# EAGLE design Logic SchematicV4-NEW (EAGLE 6.4)
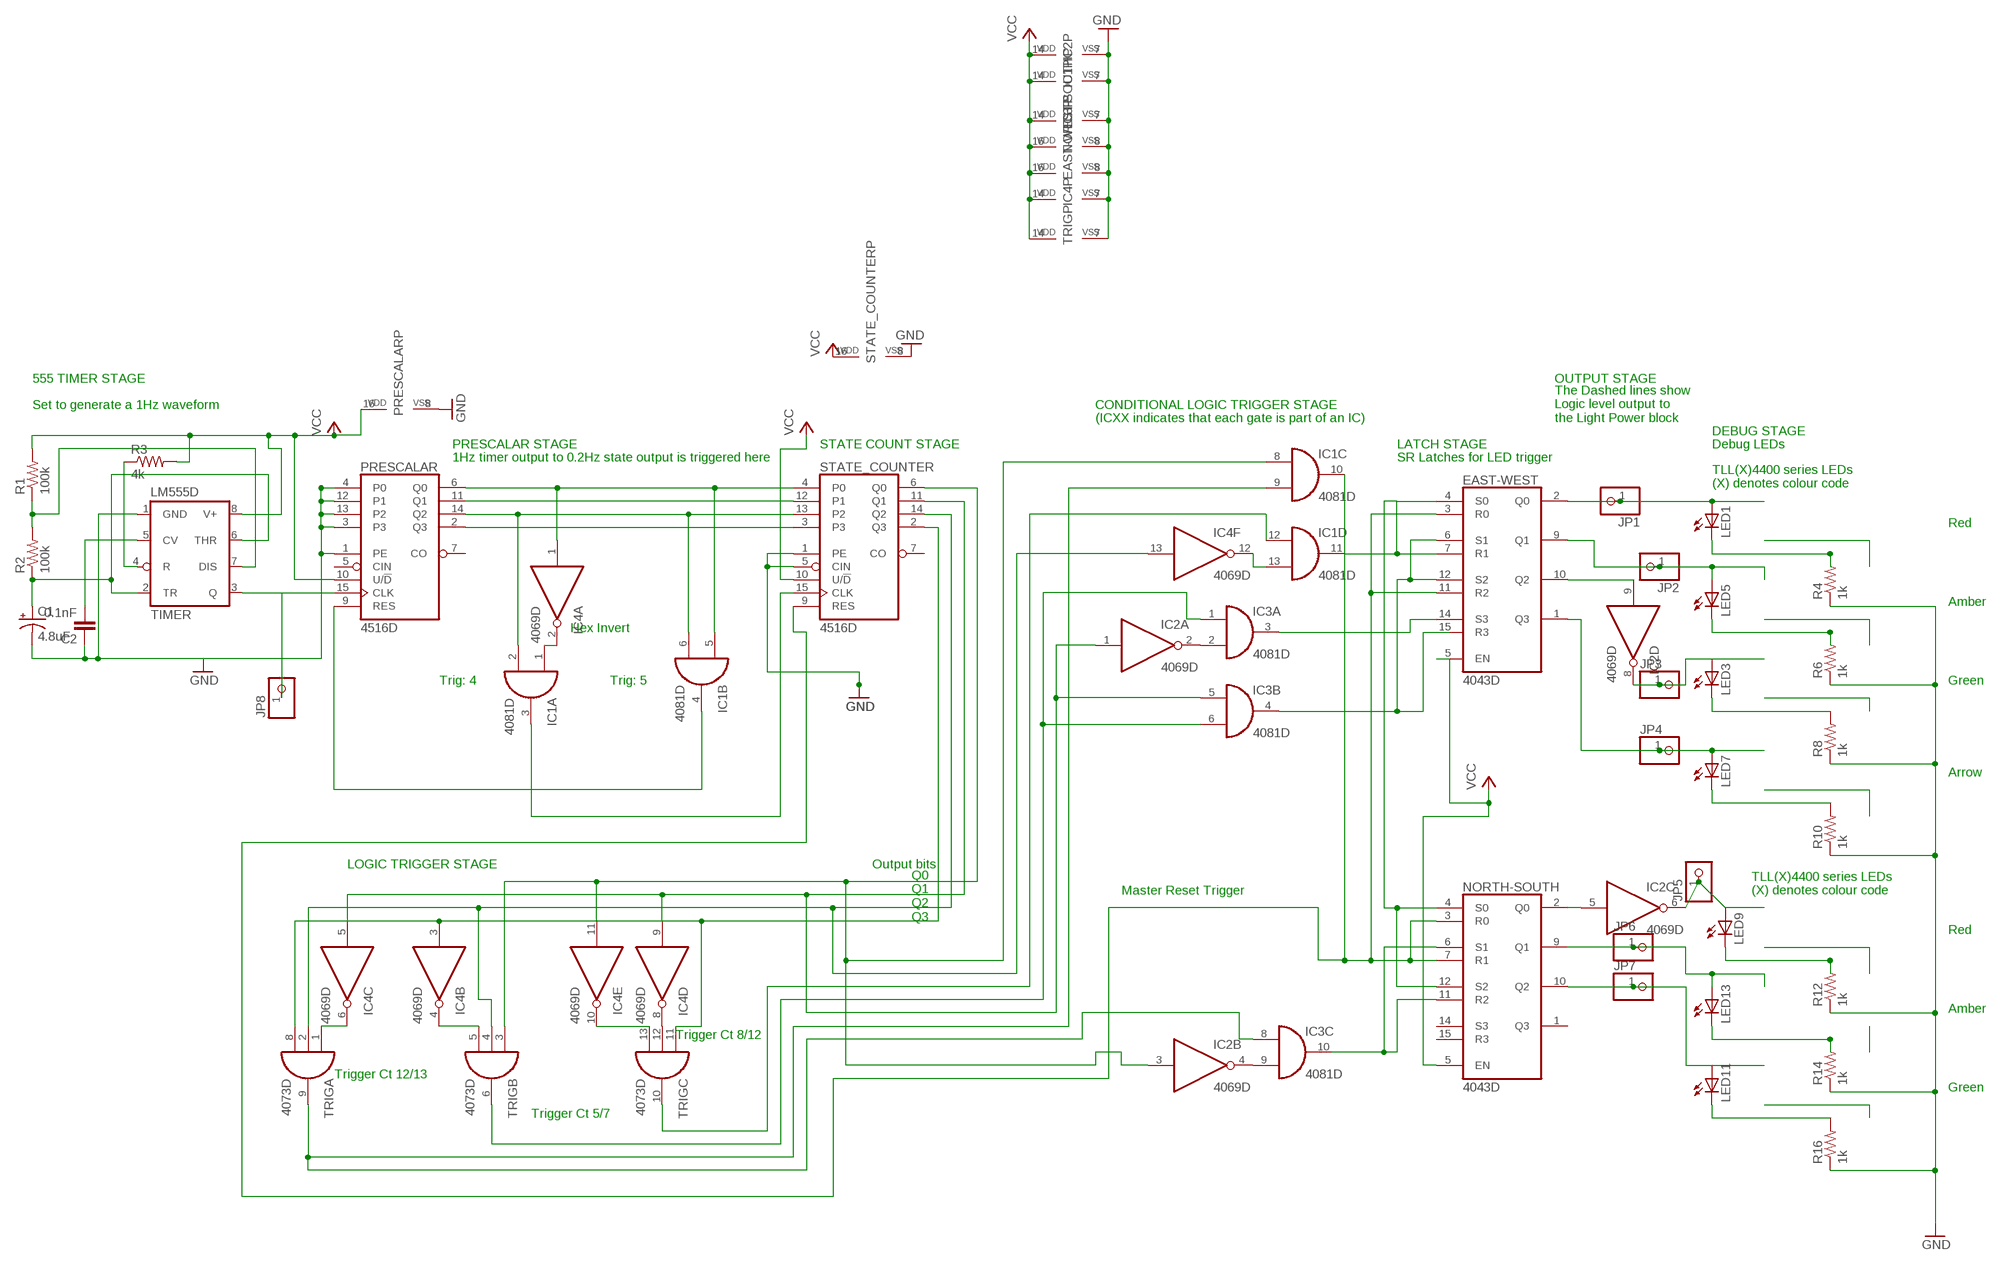
[diagram p0: schematic, sheet 1]

## Parts
C1  4.8uF  CPOL-USE5-8.5  [E5-8,5]
C2  0.1nF  C-EUC0805  [C0805]
EAST-WEST  4043D  [SO16]
IC1  4081D  [SO14]
IC2  4069D  [SO14]
IC3  4081D  [SO14]
IC4  4069D  [SO14]
JP1  PINHD-1X1  [1X01]
JP2  PINHD-1X1  [1X01]
JP3  PINHD-1X1  [1X01]
JP4  PINHD-1X1  [1X01]
JP5  PINHD-1X1  [1X01]
JP6  PINHD-1X1  [1X01]
JP7  PINHD-1X1  [1X01]
JP8  PINHD-1X1  [1X01]
LED1  LEDCHIP-LED0805  [CHIP-LED0805]
LED3  LEDCHIP-LED0805  [CHIP-LED0805]
LED5  LEDCHIP-LED0805  [CHIP-LED0805]
LED7  LEDCHIP-LED0805  [CHIP-LED0805]
LED9  LEDCHIP-LED0805  [CHIP-LED0805]
LED11  LEDCHIP-LED0805  [CHIP-LED0805]
LED13  LEDCHIP-LED0805  [CHIP-LED0805]
NORTH-SOUTH  4043D  [SO16]
PRESCALAR  4516D  [SO16]
R1  100k  R-US_M0805  [M0805]
R2  100k  R-US_M0805  [M0805]
R3  4k  R-US_M0805  [M0805]
R4  1k  R-US_M0805  [M0805]
R6  1k  R-US_M0805  [M0805]
R8  1k  R-US_M0805  [M0805]
R10  1k  R-US_M0805  [M0805]
R12  1k  R-US_M0805  [M0805]
R14  1k  R-US_M0805  [M0805]
R16  1k  R-US_M0805  [M0805]
STATE_COUNTER  4516D  [SO16]
TIMER  LM555D  [SO08]
TRIG  4073D  [SO14]

## Nets
GND: C1.- C2.1 EAST-WEST.8(VSS) IC1.7(P:VSS) IC2.7(P:VSS) IC3.7(P:VSS) IC4.7(P:VSS) NORTH-SOUTH.8(VSS) PRESCALAR.1(PE) PRESCALAR.3 PRESCALAR.4(P0) PRESCALAR.8(VSS) PRESCALAR.12(P1) PRESCALAR.13(P2) R4.1 R6.1 R8.1 R10.1 R12.1 R14.1 R16.1 STATE_COUNTER.1(PE) STATE_COUNTER.5(CIN) STATE_COUNTER.8(VSS) TIMER.1(GND) TRIG.7(P:VSS)
N$1: PRESCALAR.2(Q3) STATE_COUNTER.3
N$2: EAST-WEST.2(Q0) JP1.1 LED1.A
N$3: IC1.3(A:O) STATE_COUNTER.15(CLK)
N$4: C1.+ R2.1 TIMER.2(TR) TIMER.6(THR)
N$5: R1.1 R2.2 TIMER.7(DIS)
N$6: C2.2 TIMER.5(CV)
N$7: IC1.4(B:O) PRESCALAR.9(RES)
N$8: IC1.2(A:I1) IC1.6(B:I1) PRESCALAR.14(Q2) STATE_COUNTER.13(P2)
N$9: R3.1 TIMER.4(R)
N$10: PRESCALAR.11(Q1) STATE_COUNTER.12(P1)
N$12: IC2.2(A:O) IC3.2(A:I1)
N$13: IC3.10(C:O) NORTH-SOUTH.6(S1) NORTH-SOUTH.11(R2)
N$14: IC1.1(A:I0) IC4.2(A:O)
N$15: IC4.4(B:O) TRIG.5(B:I2)
N$16: IC1.9(C:I1) IC3.8(C:I0) TRIG.9(A:O)
N$17: IC2.1(A:I) IC3.5(B:I0) IC4.5(C:I) IC4.9(D:I) STATE_COUNTER.11(Q1)
N$18: IC4.6(C:O) TRIG.1(A:I0)
N$19: IC4.3(B:I) STATE_COUNTER.2(Q3) TRIG.8(A:I2) TRIG.11(C:I0)
N$20: JP8.1 PRESCALAR.15(CLK) TIMER.3(Q)
N$21: EAST-WEST.9(Q1) JP2.1 LED5.A
N$22: EAST-WEST.10(Q2) IC2.9(D:I)
N$23: IC2.8(D:O) JP3.1 LED3.A
N$24: LED1.C R4.2
N$26: LED5.C R6.2
N$29: EAST-WEST.1(Q3) JP4.1 LED7.A
N$30: IC4.10(E:O) TRIG.13(C:I2)
N$31: LED3.C R8.2
N$33: LED7.C R10.2
N$35: IC3.1(A:I0) IC3.6(B:I1) TRIG.6(B:O)
N$36: IC4.8(D:O) TRIG.12(C:I1)
N$37: IC2.6(C:O) JP5.1 LED9.A
N$38: JP6.1 LED13.A NORTH-SOUTH.9(Q1)
N$39: IC1.13(D:I1) IC4.12(F:O)
N$40: JP7.1 LED11.A NORTH-SOUTH.10(Q2)
N$41: LED9.C R12.2
N$43: LED13.C R14.2
N$45: IC1.12(D:I0) TRIG.10(C:O)
N$46: LED11.C R16.2
N$50: IC2.5(C:I) NORTH-SOUTH.2(Q0)
N$52: EAST-WEST.4(S0) EAST-WEST.7(R1) IC1.11(D:O) NORTH-SOUTH.4(S0) NORTH-SOUTH.12(S2)
N$53: EAST-WEST.14(S3) IC3.3(A:O)
N$54: IC2.4(B:O) IC3.9(C:I1)
N$55: EAST-WEST.6(S1) EAST-WEST.12(S2) IC3.4(B:O)
N$56: EAST-WEST.3(R0) EAST-WEST.11(R2) IC1.10(C:O) NORTH-SOUTH.3(R0) NORTH-SOUTH.7(R1) STATE_COUNTER.9(RES)
N$59: IC4.13(F:I) STATE_COUNTER.14(Q2) TRIG.2(A:I1) TRIG.4(B:I1)
N$60: IC1.8(C:I0) IC2.3(B:I) IC4.11(E:I) STATE_COUNTER.6(Q0) TRIG.3(B:I0)
NOT: IC1.5(B:I0) IC4.1(A:I) PRESCALAR.6(Q0) STATE_COUNTER.4(P0)
VCC: EAST-WEST.5(EN) EAST-WEST.16(VDD) IC1.14(P:VDD) IC2.14(P:VDD) IC3.14(P:VDD) IC4.14(P:VDD) NORTH-SOUTH.5(EN) NORTH-SOUTH.16(VDD) PRESCALAR.10(U/!D) PRESCALAR.16(VDD) R1.2 R3.2 STATE_COUNTER.10(U/!D) STATE_COUNTER.16(VDD) TIMER.8(V+) TRIG.14(P:VDD)
Unconnected: EAST-WEST.15(R3) IC2.10(E:O) IC2.11(E:I) IC2.12(F:O) IC2.13(F:I) IC3.11(D:O) IC3.12(D:I0) IC3.13(D:I1) NORTH-SOUTH.1(Q3) NORTH-SOUTH.14(S3) NORTH-SOUTH.15(R3) PRESCALAR.5(CIN) PRESCALAR.7(CO) STATE_COUNTER.7(CO)

## Notes on the sheet
- 555 TIMER STAGE | OUTPUT STAGE
- Set to generate a 1Hz waveform | CONDITIONAL LOGIC TRIGGER STAGE
- (ICXX indicates that each gate is part of an IC)
- The Dashed lines show
  Logic level output to
  the Light Power block
- DEBUG STAGE
- PRESCALAR STAGE | STATE COUNT STAGE | LATCH STAGE | Debug LEDs
- 1Hz timer output to 0.2Hz state output is triggered here | SR Latches for LED trigger
- TLL(X)4400 series LEDs
  (X) denotes colour code
- Red
- Amber
- Hex Invert
- Trig: 4 | Trig: 5 | Green
- Arrow
- LOGIC TRIGGER STAGE | Output bits
- Master Reset Trigger
- TLL(X)4400 series LEDs
  (X) denotes colour code
- Q0
  Q1
  Q2
  Q3
- Red
- Amber
- Trigger Ct 8/12
- Trigger Ct 12/13
- Green
- Trigger Ct 5/7

## Library data of the parts
C1 = resistor:CPOL-US: POLARIZED CAPACITOR, American symbol
C2 = resistor:C-EU: CAPACITOR, European symbol
EAST-WEST NORTH-SOUTH = 40xx:4043: Quad 3-state NOR R/S LATCH
IC1 IC3 = 40xx:4081: Quad 2-input AND
IC2 IC4 = 40xx:4069: Hex INVERTER
JP1-JP8 = pinhead:PINHD-1X1: PIN HEADER
LED1 LED3 LED5 LED7 LED9 LED11 LED13 = led:LED: LED OSRAM: - CHIPLED LG R971, LG N971, LY N971, LG Q971, LY Q971, LO R971, LY R971 LH N974, LH R974 LS Q976, LO Q976, LY Q976 LO Q996 - Hyper CHIPLED LW Q18S LB Q993, LB Q99A, LB R99A - SideLED LS A670, LO A670, LY A670, LG A670, LP A670 LB A673, LV A673, LT A673, LW A673 LH A674 LY A675 LS A676, LA A676, LO A676, LY A676, LW A676 LS A679, LY A679, LG A679 - Hyper Micro SIDELED® LS Y876, LA Y876, LO Y876, LY Y876 LT Y87S - SmartLED LW L88C, LW L88S LB L89C, LB L89S, LG L890 LS L89K, LO L89K, LY L89K LS L896, LA L896, LO L896, LY L896 - TOPLED LS T670, LO T670, LY T670, LG T670, LP T670 LSG T670, LSP T670, LSY T670, LOP T670, LYG T670 LG T671, LOG T671, LSG T671 LB T673, LV T673, LT T673, LW T673 LH T674 LS T676, LA T676, LO T676, LY T676, LB T676, LH T676, LSB T676, LW T676 LB T67C, LV T67C, LT T67C, LS T67K, LO T67K, LY T67K, LW E67C LS E67B, LA E67B, LO E67B, LY E67B, LB E67C, LV E67C, LT E67C LW T67C LS T679, LY T679, LG T679 LS T770, LO T770, LY T770, LG T770, LP T770 LB T773, LV T773, LT T773, LW T773 LH T774 LS E675, LA E675, LY E675, LS T675 LS T776, LA T776, LO T776, LY T776, LB T776 LHGB T686 LT T68C, LB T68C - Hyper Mini TOPLED® LB M676 - Mini TOPLED Santana® LG M470 LS M47K, LO M47K, LY M47K Source: http://www.osram.convergy.de LUXEON: - LUMILED® LXK2-PW12-R00, LXK2-PW12-S00, LXK2-PW14-U00, LXK2-PW14-V00 LXK2-PM12-R00, LXK2-PM12-S00, LXK2-PM14-U00 LXK2-PE12-Q00, LXK2-PE12-R00, LXK2-PE12-S00, LXK2-PE14-T00, LXK2-PE14-U00 LXK2-PB12-K00, LXK2-PB12-L00, LXK2-PB12-M00, LXK2-PB14-N00, LXK2-PB14-P00, LXK2-PB14-Q00 LXK2-PR12-L00, LXK2-PR12-M00, LXK2-PR14-Q00, LXK2-PR14-R00 LXK2-PD12-Q00, LXK2-PD12-R00, LXK2-PD12-S00 LXK2-PH12-R00, LXK2-PH12-S00 LXK2-PL12-P00, LXK2-PL12-Q00, LXK2-PL12-R00 Source: www.luxeon.com KINGBRIGHT: KA-3528ASYC Source: www.kingbright.com
PRESCALAR STATE_COUNTER = 45xx:4516: Binary up down COUNTER
R1-R4 R6 R8 R10 R12 R14 R16 = resistor:R-US_: RESISTOR, American symbol
TIMER = linear:*555: TIMER
TRIG = 40xx:4073: Triple 3-input AND

## Net classes
0 default: width 0.6 mm, drill 0.7 mm, clearance 0.2 mm

## Board
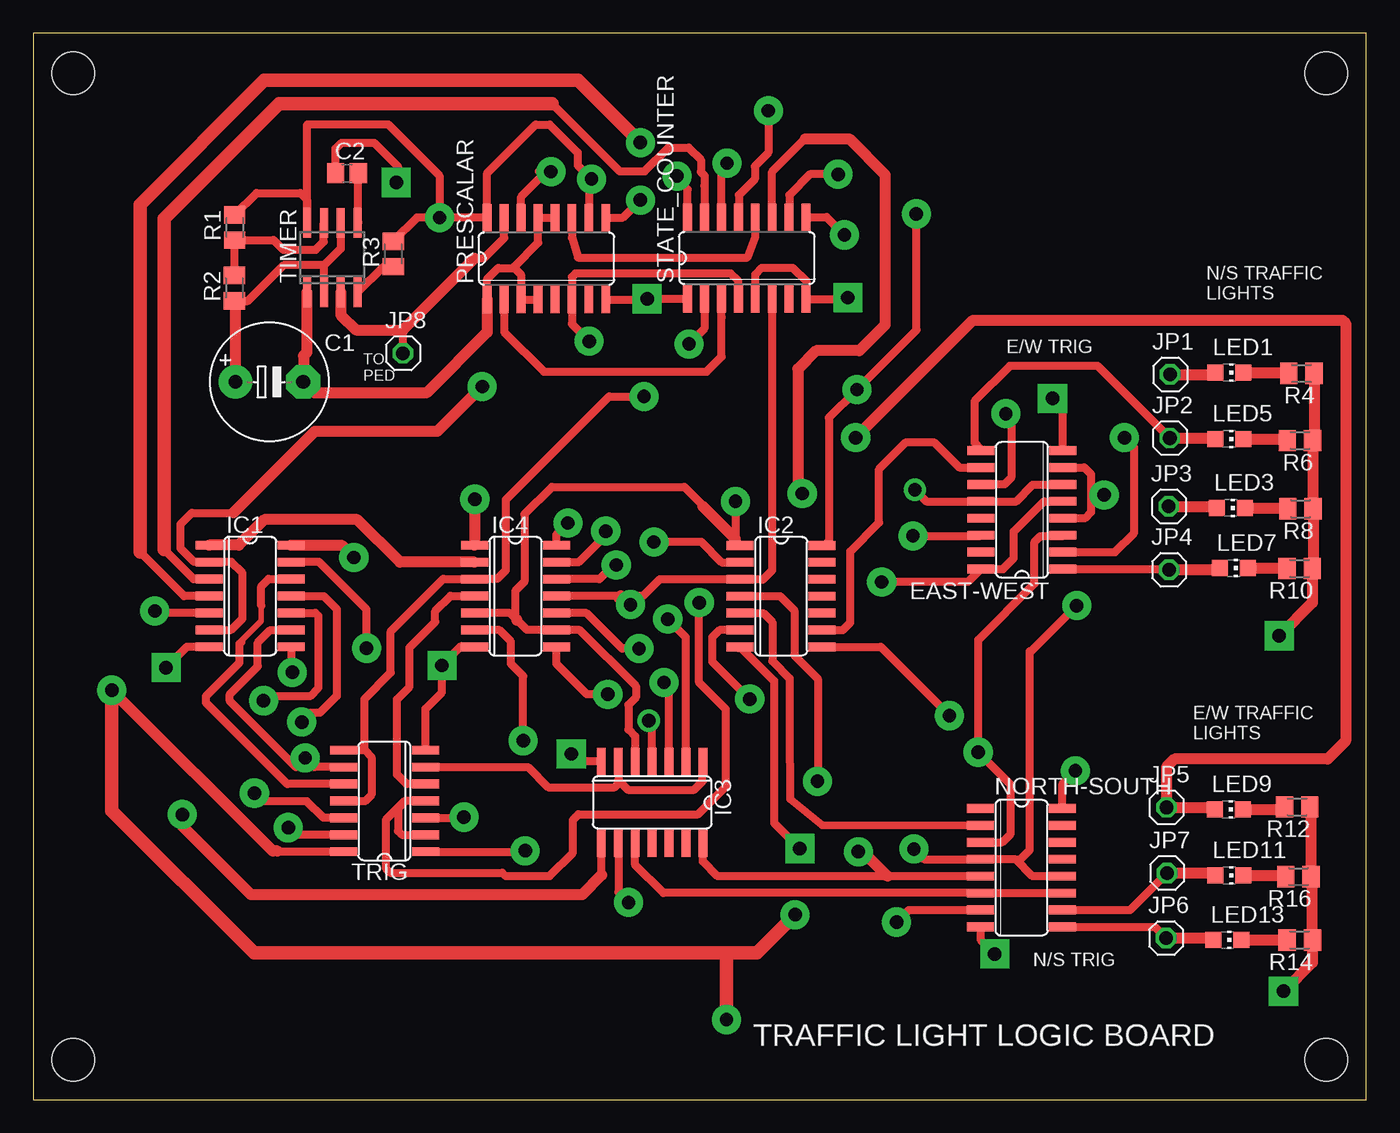
[diagram p1: board, top side]
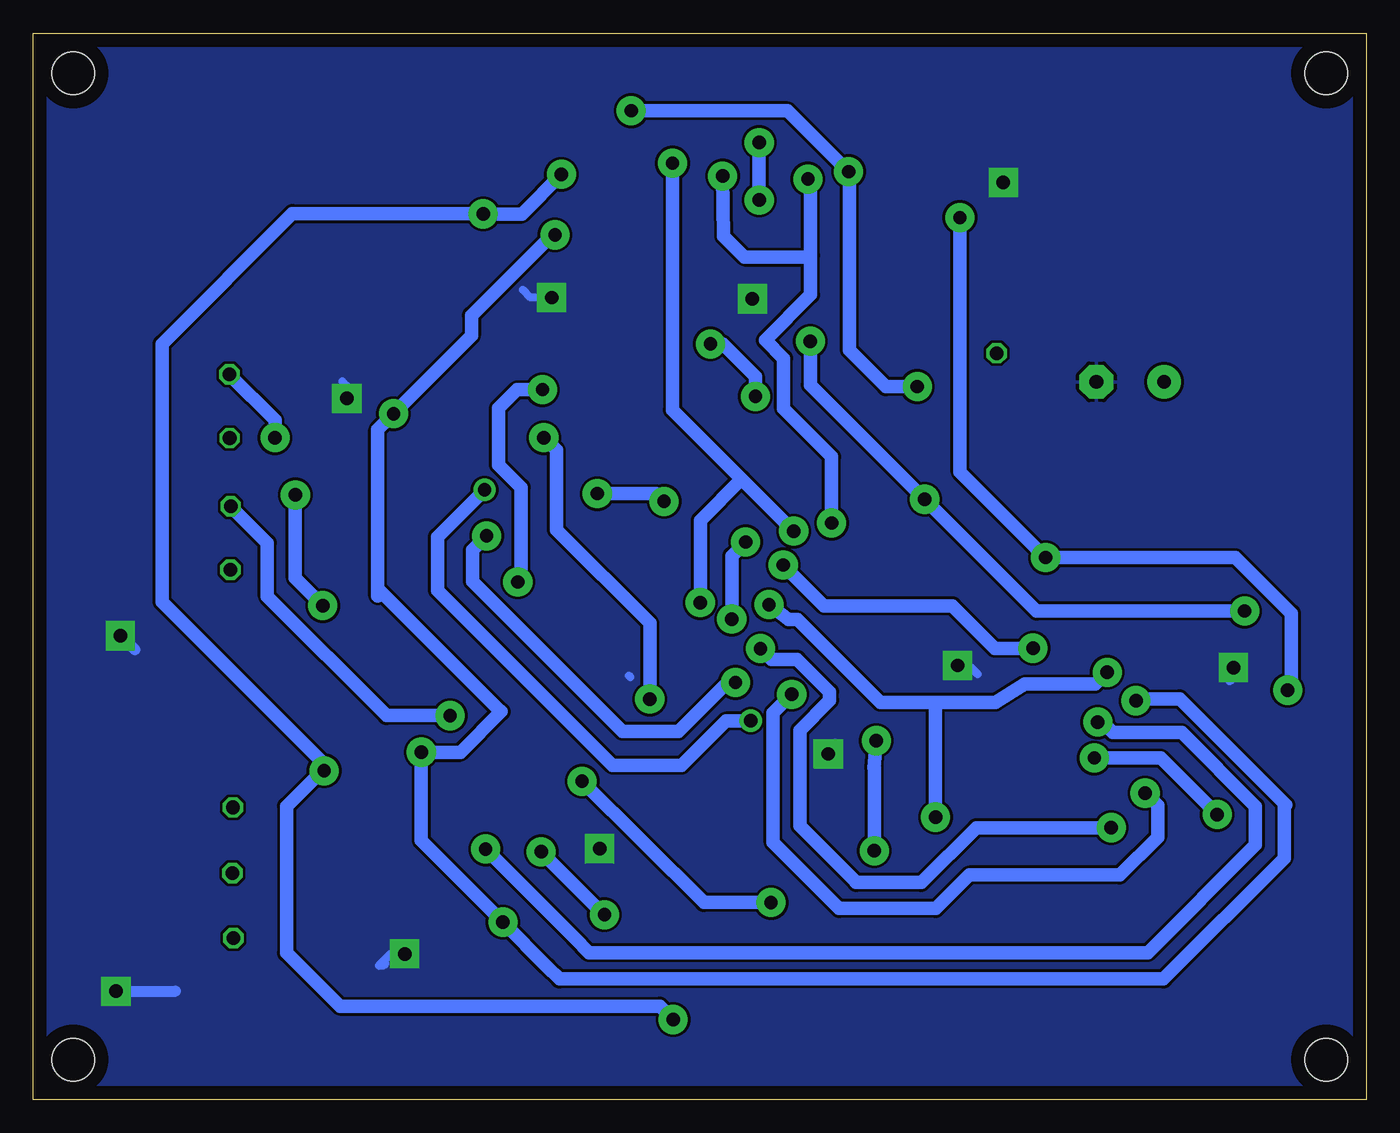
[diagram p2: board, bottom side, seen from below]

Size 100 x 80 mm. Coordinates in mm from the lower left corner, seen from the top.
Outline: 0,0 100,0 100,80 0,80 0,0
Copper layers (1*16): Top 0.035mm / dielectric 1.5mm / Bottom 0.035mm
Design rules "default": minimum track width 10mil, minimum drill 24mil, track to track 8mil, track to pad 8mil, pad to pad 8mil, via to via 8mil, smd to smd 8mil, copper to edge 40mil, drill to drill 8mil, minimum pad ring 10mil, minimum via ring 8mil, stop-mask expansion 4mil, vias tented up to drill 0mil, thermal gap 10mil
Holes 3.2 mm at 3,3 97,3 97,77 3,77

### Footprints (pad centres in the part's own frame; a part is rotated, then mirrored left to right if it is on the bottom)
E5-8,5 = drill 1.016 pad 2.54: + -2.54,0 | drill 1.016 pad 2.54 octagon: - 2.54,0
C0805 = smd 1.3 x 1.5: 1 -0.85,0; 2 0.85,0
SO16 = smd 0.66 x 2.032: 1 -4.445,-3.073; 2 -3.175,-3.073; 3 -1.905,-3.073; 4 -0.635,-3.073; 5 0.635,-3.073; 6 1.905,-3.073; 7 3.175,-3.073; 8 4.445,-3.073; 9 4.445,3.073; 10 3.175,3.073; 11 1.905,3.073; 12 0.635,3.073; 13 -0.635,3.073; 14 -1.905,3.073; 15 -3.175,3.073; 16 -4.445,3.073
SO14 = smd 0.66 x 2.032: 1 -3.81,-3.073; 2 -2.54,-3.073; 3 -1.27,-3.073; 4 0,-3.073; 5 1.27,-3.073; 6 2.54,-3.073; 7 3.81,-3.073; 8 3.81,3.073; 9 2.54,3.073; 10 1.27,3.073; 11 0,3.073; 12 -1.27,3.073; 13 -2.54,3.073; 14 -3.81,3.073
1X01 = drill 1.016 octagon: 1 0,0
CHIP-LED0805 = smd 1.2 x 1.2: A 0,-1.05; C 0,1.05
M0805 = smd 1.3 x 1.6: 1 -0.95,0; 2 0.95,0
SO08 = smd 0.6 x 2.2: 1 -1.905,-2.6; 2 -0.635,-2.6; 3 0.635,-2.6; 4 1.905,-2.6; 5 1.905,2.6; 6 0.635,2.6; 7 -0.635,2.6; 8 -1.905,2.6

### Placement (x,y rotation side)
C1  17.7,53.85 0 top
C2  23.53,69.5 0 top
EAST-WEST  74.17,44.25 90 top
IC1  16.26,37.78 270 top
IC2  56.1,37.77 270 top
IC3  46.43,22.29 180 top
IC4  36.17,37.77 270 top
JP1  85.29,54.41 0 top
JP2  85.27,49.63 0 top
JP3  85.19,44.5 0 top
JP4  85.22,39.75 0 top
JP5  85.01,21.92 0 top
JP6  84.99,12.12 0 top
JP7  85.06,16.99 0 top
JP8  27.74,56 0 top
LED1  89.75,54.55 270 top
LED3  89.85,44.39 270 top
LED5  89.72,49.57 270 top
LED7  90.05,39.87 270 top
LED9  89.68,21.77 270 top
LED11  89.73,16.82 270 top
LED13  89.6,11.96 270 top
NORTH-SOUTH  74.14,17.4 270 top
PRESCALAR  38.5,63.1 0 top
R1  15.11,65.43 90 top
R2  15.09,60.89 90 top
R3  27.01,63.44 90 top
R4  95.14,54.49 180 top
R6  95.04,49.45 180 top
R8  95.06,44.31 180 top
R10  95.01,39.84 180 top
R12  94.82,21.96 180 top
R14  95.01,11.97 180 top
R16  94.92,16.73 180 top
STATE_COUNTER  53.53,63.14 0 top
TIMER  22.44,63.17 0 top
TRIG  26.34,22.4 90 top

### Tracks (layer width: path | path; a pad name or v marks a point on that pad's centre or on a via)
GND  (via drill 1 pad 2.18)
  Top 0.61: TIMER.1 | PRESCALAR.1 34.05,61.56 34.87,62.38 36.09,62.38 | 36.09,62.38 36.58,61.9 36.58,60.04 PRESCALAR.3 PRESCALAR.4 | PRESCALAR.12 PRESCALAR.13 37.87,66.17 37.87,64.29 36.09,62.51 36.09,62.38 | STATE_COUNTER.1 v46.05,60.07 46.01,60.03 PRESCALAR.8 | IC4.7 32.11,34.01 v30.66,32.56 30.66,30.56 29.42,29.32 TRIG.7 | IC1.7 11.52,33.97 v9.96,32.41 | v61.11,60.17 61.01,60.07 STATE_COUNTER.8 57.99,60.08 57.99,61.39 56.97,62.41 54.66,62.41 54.16,61.91 STATE_COUNTER.5 | IC3.7 40.93,25.36 v40.36,25.93 | NORTH-SOUTH.8 71.07,11.99 v72.14,10.92 | 52.93,33.86 IC2.7 55.58,31.41 55.58,20.75 v57.51,18.82 | EAST-WEST.8 77.25,51.84 v76.48,52.6 | C2.1 22.68,71.35 23.11,71.78 25.58,71.78 27.36,70 27.36,68.94 v27.23,68.81
  Top 0.813: TIMER.1 20.52,56.06 20.27,55.8 20.27,53.82 | 20.27,53.19 20.27,53.82 | 20.27,53.82 C1.- 21.08,53.01 29.49,53.01 34.05,57.58 PRESCALAR.1 | R4.1 96.09,49.55 R6.1 95.99,44.34 R8.1 96.01,39.9 R10.1 95.96,37.29 v93.47,34.8 | R12.1 95.87,21.86 R16.1 95.96,16.63 R14.1 95.96,10.29 v93.8,8.13
  Bottom 0.61: v46.05,60.07 46.05,60.58 46.18,60.71 | v30.66,32.56 29.74,32.51 29.16,31.93 | v9.96,32.41 9.96,31.65 10.24,31.37 | v61.11,60.17 62.69,60.17 63.27,60.76 | v40.36,25.93 40.36,26.26 39.85,26.77 | 55.19,31.67 55.32,31.8 | v72.14,10.92 73.2,10.92 74.09,10.03 74.07,10.03 74.02,10.08 73.69,10.08 73.58,10.19 | v76.48,52.6 76.48,53.54 76.81,53.87 | v27.23,68.81 27.3,68.81 27.76,68.35
  Bottom 0.813: v93.47,34.8 93.42,34.8 92.38,33.76 | v93.8,8.13 89.33,8.13
  pour Bottom: 0,0 100,0 100,80 0,80
N$1
  Top 0.61: PRESCALAR.2 35.32,57.59 38.3,54.61 50.52,54.61 51.64,55.73 51.64,58.7 51.64,59.21 51.64,60.05 STATE_COUNTER.3
N$2  (via drill 1 pad 2.18)
  Top 0.61: EAST-WEST.2 81.16,41.07 82.6,42.52 82.6,48.92 v81.86,49.66
  Top 0.813: JP1.1 88.55,54.41 LED1.A
  Bottom 1.016: v81.86,49.66 81.86,50.98 JP1.1
N$3
  Top 0.61: IC1.3 12.03,39.05 9.8,41.27 | 50.34,66.23 STATE_COUNTER.15 50.35,68.54 50.37,68.56 50.37,69.32 50.09,69.6 50.09,70.51 49.17,71.42 47.65,71.42 45.87,69.65 43.99,69.65 38.91,74.73
  Top 1.016: 9.8,41.27 9.8,66.09 18.44,74.73 38.91,74.73
N$4
  Top 0.61: TIMER.6 23.07,63.84 21.79,62.56 | 21.79,62.56 TIMER.2 | R2.1 15.11,59.91 16.09,59.91 18.82,62.64 21.72,62.64 21.79,62.56
  Top 0.813: C1.+ 15.16,59.86 R2.1
N$5
  Top 0.61: R2.2 15.09,64.48 R1.1 18.02,64.48 18.75,63.75 21.18,63.75 21.79,64.36 TIMER.7
N$6
  Top 0.61: TIMER.5 24.38,65.81 C2.2
N$7  (via drill 1 pad 2.18)
  Top 0.61: PRESCALAR.9 44.23,66.17 v45.54,67.49 | IC1.4 11.32,37.78 8,41.1
  Top 1.016: 8,41.1 8,67.16 17.32,76.48 40.87,76.48 v45.54,71.81
  Bottom 0.61: v45.54,67.49 45.54,66.98 45.54,66.75
  Bottom 1.016: v45.54,71.81 45.54,66.98
N$8  (via drill 1 pad 2.18)
  Top 0.61: PRESCALAR.14 36.59,67.73 38.48,69.62 v38.84,69.62 | 37.92,69.62 38.68,69.62 | STATE_COUNTER.13 52.93,66.25 52.93,67.87 54.13,69.06 54.13,70.03 55.14,71.04 v55.14,74.19 | IC1.6 14.84,35.24 15.7,36.09 15.7,39.5 14.86,40.34 13.21,40.34 | 13.21,40.34 IC1.2 | 13.21,40.34 12.06,40.34 11.05,41.35 11.05,43.18 11.89,44.02 15.01,44.02
  Top 0.813: 15.01,44.02 21.13,50.14 30.33,50.14 v33.68,53.49
  Top 1.016: v38.84,69.62 38.68,69.62
  Bottom 1.016: v33.68,53.49 36.04,53.49 38.79,56.24 38.79,69.57 v38.84,69.62 43.41,74.19 v55.14,74.19
N$9
  Top 0.61: TIMER.4 26.26,62.49 R3.1
N$10
  Top 0.61: PRESCALAR.11 40.4,64.65 40.87,63.19 53.57,63.19 54.18,64.8 54.18,66.2 STATE_COUNTER.12
N$12  (via drill 1 pad 2.18)
  Top 0.61: IC2.2 51.64,40.31 50.11,41.83 v46.56,41.83 | IC3.2 48.97,34.67 v47.6,36.04
  Bottom 1.016: v47.6,36.04 47.6,40.79 v46.56,41.83
N$13
  Top 0.61: IC3.10 45.16,17.6 47.27,15.49 NORTH-SOUTH.6 NORTH-SOUTH.11
N$14
  Top 0.813: IC4.2 27.5,40.31 24.31,43.51 17.32,43.51 15.42,41.6 13.21,41.6 IC1.1
N$15
  Top 0.61: TRIG.5 27.99,23.67 27.28,24.38 27.28,30.02 28.22,30.96 28.22,33.91 30.15,35.84 30.15,36.65 31.29,37.8 33.08,37.8 IC4.4
N$16  (via drill 1 pad 2.18)
  Top 0.61: IC1.9 19.33,35.23 17.78,35.23 16.84,34.29 16.84,32.51 14.73,30.4 14.73,29.9 19.68,24.94 TRIG.9 21.08,24.94 v20.4,25.63 | 42.65,16.84 42.65,19.19 IC3.8
  Top 0.813: v11.18,21.39 11.18,20.52 16.31,15.39 41.2,15.39 42.65,16.84
  Bottom 1.016: v20.4,25.63 15.42,25.63 v11.18,21.39
N$17  (via drill 1 pad 2.18)
  Top 0.61: 36.14,36.12 36.28,35.98 37.03,35.23 IC4.9 41,35.23 45.21,31.01 45.21,30.18 44.65,29.62 44.65,27.76 45.16,27.25 45.16,26.49 IC3.5 | 36.14,36.12 35.76,36.5 IC4.5 | STATE_COUNTER.11 55.44,69.61 57.91,72.08 | v52.68,44.88 52.68,42.06 52.68,41.93 IC2.1 | 36.14,36.12 36.14,38.15 36.85,38.86 36.85,43.92 38.91,45.97 48.84,45.97 50.49,44.32 50.49,44.25
  Top 0.813: 57.91,72.08 61.21,72.08 63.91,69.39 63.91,58.12 61.98,56.19 58.73,56.19 57.35,54.81 57.35,45.8 v57.68,45.47 | 52.68,41.93 52.68,41.63 | 36.27,35.99 36.28,35.98 | 50.22,44.53 50.49,44.25 52.68,42.06
  Bottom 1.016: v57.68,45.47 53.26,45.47 v52.68,44.88
N$18  (via drill 1 pad 2.18)
  Top 0.61: IC4.6 34.98,35.23 35.84,34.37 35.84,32.69 36.75,31.77 v36.75,26.92 | TRIG.1 36.83,18.59 v36.91,18.67
  Bottom 1.016: v36.75,26.92 36.93,24.89 36.91,24.87 v36.91,18.67
N$19  (via drill 1 pad 2.18)
  Top 0.61: STATE_COUNTER.2 50.35,57.85 v49.2,56.69 | TRIG.8 24.84,26.21 | 24.84,26.21 25.38,25.68 25.38,22.86 24.89,22.38 23.3,22.38 TRIG.11 | 24.84,26.21 24.84,30.05 26.82,32.03 26.82,35.13 30.76,39.06 33.08,39.06 IC4.3 34.52,39.04 34.57,39.09 34.82,39.09 35.43,39.7 35.43,44.98 43.2,52.76 v45.82,52.76
  Bottom 1.016: v49.2,56.69 48.26,56.69 45.82,54.25 v45.82,52.76
N$20
  Top 0.61: 33.12,63.12 33.81,63.12 35.33,64.64 35.33,66.17 PRESCALAR.15 | JP8.1 27.74,57.73
  Top 0.813: TIMER.3 23.07,58.87 24.21,57.73 27.74,57.73 27.76,57.76 33.12,63.12
N$21
  Top 0.61: JP2.1 79.86,55.04 73.25,55.04 70.61,52.4 70.61,49.28 71.1,48.79 EAST-WEST.9
  Top 0.813: JP2.1 88.61,49.63 LED5.A
N$22
  Top 0.61: IC2.9 60.73,35.23 61.29,35.79 61.29,41.12 63.45,43.28 63.45,47.3 65.48,49.33 67.56,49.33 69.47,47.42 EAST-WEST.10
N$23  (via drill 1 pad 2.18)
  Top 0.61: IC2.8 63.58,33.96 v68.73,28.8
  Top 0.813: JP3.1 88.69,44.5 LED3.A
  Bottom 1.016: v68.73,28.8 73.51,28.8 82.45,37.74 82.45,41.76 JP3.1
N$24
  Top 0.813: LED1.C 94.13,54.55 R4.2
N$26
  Top 0.813: LED5.C 93.96,49.57 R6.2
N$29
  Top 0.61: EAST-WEST.1 85.16,39.8 JP4.1
  Top 0.813: JP4.1 88.88,39.75 LED7.A
N$30  (via drill 1 pad 2.18)
  Top 0.61: TRIG.13 19.66,19.86 v19.13,20.4 | v45.44,33.83 44.17,33.83 41.5,36.5 IC4.10
  Bottom 1.016: v19.13,20.4 29.26,20.4 33.38,16.28 38.28,16.28 38.28,16.33 42.49,20.55 42.49,27.71 40.26,29.95 40.26,30.58 42.7,33.02 44.63,33.02 v45.44,33.83
N$31
  Top 0.813: LED3.C 94.04,44.39 R8.2
N$33
  Top 0.813: LED7.C 94.04,39.87 R10.2
N$35
  Top 0.61: IC3.6 43.89,23.95 44.02,23.82 | 44.02,23.82 44.6,23.24 49.58,23.24 50.22,23.88 50.22,25.34 IC3.1 | TRIG.6 37.11,24.94 38.63,23.42 43.61,23.42 44.02,23.82
N$36  (via drill 1 pad 2.18)
  Top 0.61: TRIG.12 21.77,21.13 20.52,22.38 17.2,22.38 v16.59,22.99 | v43.1,30.4 41.53,30.4 39.24,32.69 IC4.8
  Bottom 1.016: v16.59,22.99 16.56,22.99 15.65,22.07 15.65,19.68 18.49,16.84 29.77,16.84 32.28,14.33 39.55,14.33 44.5,19.28 44.5,29.01 v43.1,30.4
N$37  (via drill 1 pad 2.18)
  Top 0.61: IC2.6 51.48,35.23 50.93,34.67 50.93,32.87 v53.75,30.05
  Top 0.813: v61.7,49.66 70.51,58.47 98.22,58.47 98.45,58.24 98.45,26.9 97.1,25.55 85.62,25.55 85.01,24.94 JP5.1 88.47,21.92 LED9.A
  Bottom 1.016: v53.75,30.05 53.75,35.74 60.76,42.75 60.76,48.72 v61.7,49.66
N$38
  Top 0.61: NORTH-SOUTH.9 84.15,12.95 JP6.1
  Top 0.813: JP6.1 88.4,12.12 LED13.A
N$39  (via drill 1 pad 2.18)
  Top 0.61: v43.74,40.11 43.54,40.11 42.47,39.04 IC4.12 | v24.99,33.86 24.99,36.78 21.44,40.34 19.35,40.34 IC1.13
  Bottom 1.016: v24.99,33.86 27.86,33.86 31.04,37.03 40.66,37.03 v43.74,40.11
N$40
  Top 0.61: NORTH-SOUTH.10 82.29,14.22 JP7.1
  Top 0.813: JP7.1 88.5,16.99 LED11.A
N$41
  Top 0.813: LED9.C 93.68,21.77 R12.2
N$43
  Top 0.813: LED13.C R14.2
N$45
  Top 0.406: 15.6,34.31 15.6,34.42 17.09,35.92 17.09,37.03
  Top 0.61: TRIG.10 19.05,23.67 12.95,29.77 12.95,30.28 15.47,32.79 15.47,34.19 15.6,34.31 | 17.09,37.03 17.09,38.51 17.65,39.06 19.32,39.06 IC1.12
N$46
  Top 0.813: LED11.C 93.88,16.82 R16.2
N$50
  Top 0.61: IC2.5 54.77,36.5 55.45,35.81 55.45,32.89 56.74,31.6 56.74,25.58 56.77,24.87 56.77,22.55 59.18,20.6 NORTH-SOUTH.2
N$52  (via drill 1 pad 2.18)
  Top 0.61: IC1.11 21.78,37.78 22.76,36.8 22.76,30.28 21.49,29.01 20.83,29.01 v20.14,28.32 | 71.04,18.06 NORTH-SOUTH.4 | v66.06,18.8 66.83,18.03 NORTH-SOUTH.4 | NORTH-SOUTH.12 74.96,16.76 73.71,18.01 | 73.71,18.01 71.09,18.01 NORTH-SOUTH.4 | 73.71,18.01 74.04,18.01 74.75,18.72 74.75,33.63 74.85,33.63 v78.28,37.06 | EAST-WEST.7 78.84,47.42 79.35,46.91 79.35,45.7 | 79.35,45.7 79.35,44.07 78.89,43.61 EAST-WEST.4 | v80.34,45.36 80.01,45.7 79.35,45.7
  Bottom 1.016: v20.14,28.32 19.81,28.32 19.02,27.53 13.84,27.53 8.31,22 8.31,19.1 16.38,11.02 58.32,11.02 59.41,12.12 v66.06,18.8 | v78.28,37.06 80.34,39.12 v80.34,45.36
N$53  (via drill 1 pad 2.18)
  Top 0.61: IC3.3 47.7,30.91 v47.32,31.29 | v65.99,42.29 71.05,42.29 EAST-WEST.14
  Bottom 1.016: v47.32,31.29 47.93,31.29 51.59,27.64 55.8,27.64 67.06,38.89 67.06,41.22 v65.99,42.29
N$54  (via drill 1 pad 2.18)
  Top 0.61: IC3.9 43.89,15.55 v44.65,14.78 | IC2.4 56.04,37.77 57.1,36.7 57.1,33.33 58.85,31.57 58.85,23.95 v58.83,23.88
  Bottom 1.016: v44.65,14.78 49.68,14.78 v58.83,23.88
N$55  (via drill 1 pad 1.68)
  Top 0.61: IC3.4 46.43,28.27 v46.18,28.42 | v66.14,45.74 67,44.88 EAST-WEST.12 73.74,44.88 74.98,46.13 77.22,46.13 EAST-WEST.6
  Bottom 1.016: v46.18,28.42 48.03,28.4 51.36,25.07 56.54,25.07 69.67,38.2 69.67,42.22 v66.14,45.74
N$56  (via drill 1 pad 2.18)
  Top 0.61: IC1.10 21.17,36.51 21.39,36.3 21.39,30.89 20.75,30.25 18.01,30.25 17.68,29.92 v17.27,29.92 | 71.04,14.2 NORTH-SOUTH.7 65.68,14.22 v64.77,13.31 | NORTH-SOUTH.3 72.69,19.3 73.33,19.94 73.33,23.62 v70.89,26.06 70.89,34.49 75.11,38.71 75.11,41.83 75.54,42.27 77.17,42.27 EAST-WEST.3 | STATE_COUNTER.9 59.52,66.22 v60.86,64.87 | v72.97,51.46 72.97,51.44 73.38,51.03 73.38,46.66 72.87,46.15 EAST-WEST.11
  Bottom 1.016: v17.27,29.92 16.97,30.07 13.99,30.07 6.15,22.23 | 6.15,22.23 6.02,22.1 | 6.15,22.23 6.15,18.11 15.21,9.04 60.53,9.04 61.44,9.96 v64.77,13.31 70.89,19.43 v70.89,26.06 67.94,26.06 64.9,29.11 64.95,29.11 74.17,38.33 | v60.86,64.87 61.09,64.87 67.13,58.83 67.13,57.3 v72.97,51.46 74.17,50.27 74.17,38.33 | 74.17,37.8 74.17,38.33
N$59  (via drill 1 pad 2.18)
  Top 0.61: STATE_COUNTER.14 51.62,69.84 v52.05,70.26 | v42.95,42.65 42.95,42.37 40.89,40.31 IC4.13 | TRIG.2 27.64,19.86 27.36,20.14 27.36,21.84 27.91,22.4 TRIG.4 27.86,22.4 26.44,20.98 26.44,17.35 26.77,17.02 35.18,17.02 35.43,16.76 38.73,16.76 40.49,18.52 40.49,20.98 40.66,21.16 40.66,21.18 40.89,21.41 49.89,21.41 51.97,23.5 51.97,29.29 49.96,31.29 v49.96,37.29
  Bottom 1.016: v52.05,70.26 52.05,51.74 46.86,46.56 | 46.86,46.56 v42.95,42.65 | 46.86,46.56 49.96,43.46 v49.96,37.29
N$60  (via drill 1 pad 2.18)
  Top 0.61: STATE_COUNTER.6 55.44,39.71 54.74,39.01 53.05,39.01 IC2.3 46.99,39.04 45.74,37.8 44.07,37.8 39.27,37.8 IC4.11 | IC1.8 19.34,31.25 v19.43,32.05 | TRIG.3 32.26,21.13 v32.31,21.18
  Top 0.813: v44.81,37.13 43.92,37.64 44.07,37.8
  Bottom 1.016: 32.54,29.79 27.81,29.79 25.6,31.17 20.32,31.17 v19.43,32.05 | 32.54,29.79 36.45,29.79 42.67,36.02 43.33,36.02 v44.81,37.13 | v32.31,21.18 32.31,29.57 32.54,29.79
NOT  (via drill 1 pad 2.18)
  Top 0.61: STATE_COUNTER.4 52.9,61.41 52.32,61.98 40.66,61.98 40.41,61.72 40.41,60.03 | 40.41,60.03 PRESCALAR.6 | 40.41,60.03 40.41,58.19 v41.71,56.9 | IC1.5 9.26,36.51 v9.12,36.65
  Top 0.813: v33.12,45.03 33.12,41.61 IC4.1
  Bottom 1.016: v41.71,56.9 41.71,53.62 v33.12,45.03 24.74,36.65 v9.12,36.65
VCC  (via drill 1 pad 2.18)
  Top 0.61: 30.63,66.17 PRESCALAR.16 34.05,69.51 37.69,73.15 38.73,73.15 40.84,71.04 40.84,70.1 v41.88,69.06 41.68,68.86 PRESCALAR.10 | R3.2 28.79,66.17 v30.48,66.17 30.48,69.32 26.62,73.18 20.55,73.18 20.55,65.79 TIMER.8 20.53,67.53 20.04,68.02 16.74,68.02 R1.2 | TRIG.14 18.36,18.59 18.31,18.64 | NORTH-SOUTH.5 64.08,16.76 51.34,16.76 50.24,17.86 IC3.14 | EAST-WEST.5 75.82,44.88 73.56,42.62 73.56,40.62 72.75,39.8 EAST-WEST.16 70.13,38.84 v63.65,38.84 | IC4.14 39.24,42.39 v40.11,43.26 | v61.8,53.26 66.27,57.73 66.27,66.42 v66.24,66.45 | v60.38,69.42 58.27,69.42 56.72,67.87 56.72,66.23 STATE_COUNTER.10 | STATE_COUNTER.16 49.09,68.29 v48.28,69.29 | NORTH-SOUTH.16 77.21,23.7 v78.18,24.66 | 61.67,53.14 59.69,51.16 59.69,41.91 59.36,41.58 IC2.14
  Top 0.813: 18.31,18.64 17.96,18.64 6.2,30.4 | IC1.14 23.13,41.59 v24.05,40.66 | v61.9,18.59 62.25,18.59 64.08,16.76
  Top 1.016: 6.2,30.4 v5.89,30.71 5.89,21.67 16.56,11 52,11 | v30.48,66.17 30.63,66.17 | v61.8,53.26 61.67,53.14 | 52,11 54.28,11 v57.15,13.87 | v52,6 52,11
  Bottom 1.016: v5.89,30.71 5.61,30.99 5.61,36.47 9.8,40.66 v24.05,40.66 30.48,47.09 v30.48,66.17 | v40.11,43.26 40.11,48.23 43.71,51.84 43.71,55.6 45.09,56.97 41.68,60.38 41.68,63.35 | 41.68,63.35 41.68,68.86 v41.88,69.06 | v60.38,69.42 63.35,66.45 v66.24,66.45 66.27,66.47 80.57,66.47 90.35,56.69 90.35,37.34 78.18,25.17 v78.18,24.66 78.34,24.66 81,22 81,11 77,7 53,7 v52,6 | v48.28,69.29 48.21,64.77 46.63,63.22 41.81,63.22 41.68,63.35 | v63.65,38.84 63.4,39.09 63.4,45.92 65.1,47.62 65.1,51.87 63.7,53.26 v61.8,53.26 | v57.15,13.87 57.17,13.87 v61.9,18.59

### Text on the board
tPlace: N/S TRAFFIC / LIGHTS | E/W TRIG | TO / PED | E/W TRAFFIC / LIGHTS | N/S TRIG | TRAFFIC LIGHT LOGIC BOARD